# EAGLE design led_driver (EAGLE 6.5.0)
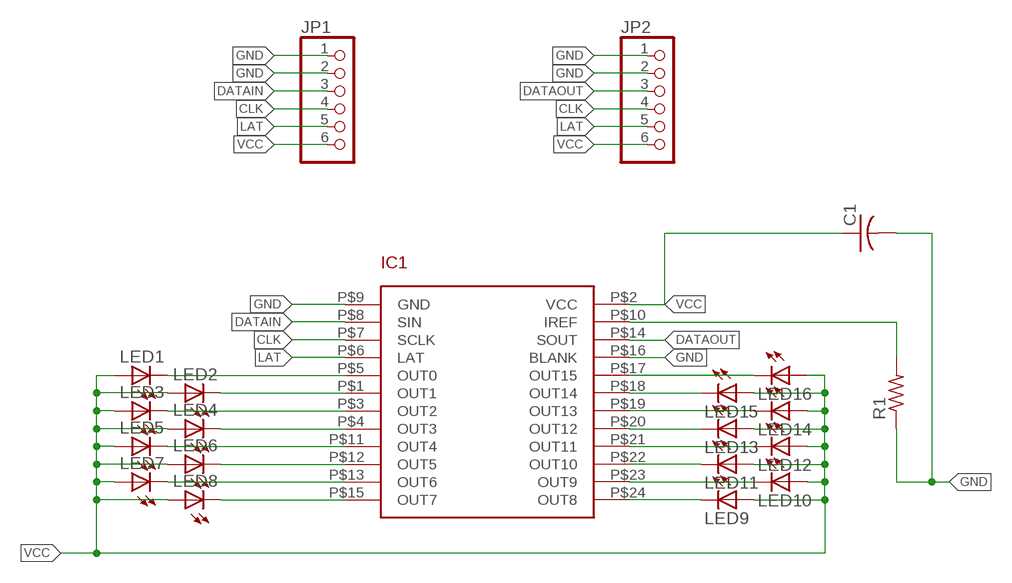
[diagram p0: schematic, sheet 1]

## Parts
C1  C-USC1206  [C1206]
IC1  TLC59282  [SSOP-24]
JP1  PINHD-1X6  [1X06]
JP2  PINHD-1X6  [1X06]
LED1  LED3MM  [LED3MM]
LED2  LED3MM  [LED3MM]
LED3  LED3MM  [LED3MM]
LED4  LED3MM  [LED3MM]
LED5  LED3MM  [LED3MM]
LED6  LED3MM  [LED3MM]
LED7  LED3MM  [LED3MM]
LED8  LED3MM  [LED3MM]
LED9  LED3MM  [LED3MM]
LED10  LED3MM  [LED3MM]
LED11  LED3MM  [LED3MM]
LED12  LED3MM  [LED3MM]
LED13  LED3MM  [LED3MM]
LED14  LED3MM  [LED3MM]
LED15  LED3MM  [LED3MM]
LED16  LED3MM  [LED3MM]
R1  R-US_0207/10  [0207/10]

## Nets
CLK: IC1.P$7(SCLK) JP1.4 JP2.4
DATAIN: IC1.P$8(SIN) JP1.3
DATAOUT: IC1.P$14(SOUT) JP2.3
GND: C1.2 IC1.P$9(GND) IC1.P$16(BLANK) JP1.1 JP1.2 JP2.1 JP2.2 R1.1
LAT: IC1.P$6(LAT) JP1.5 JP2.5
N$1: IC1.P$5(OUT0) LED1.K(C)
N$2: IC1.P$1(OUT1) LED2.K(C)
N$3: IC1.P$3(OUT2) LED3.K(C)
N$4: IC1.P$4(OUT3) LED4.K(C)
N$5: IC1.P$11(OUT4) LED5.K(C)
N$6: IC1.P$12(OUT5) LED6.K(C)
N$7: IC1.P$13(OUT6) LED7.K(C)
N$8: IC1.P$15(OUT7) LED8.K(C)
N$10: IC1.P$17(OUT15) LED16.K(C)
N$11: IC1.P$18(OUT14) LED15.K(C)
N$12: IC1.P$19(OUT13) LED14.K(C)
N$13: IC1.P$20(OUT12) LED13.K(C)
N$14: IC1.P$21(OUT11) LED12.K(C)
N$15: IC1.P$22(OUT10) LED11.K(C)
N$16: IC1.P$23(OUT9) LED10.K(C)
N$17: IC1.P$24(OUT8) LED9.K(C)
N$19: IC1.P$10(IREF) R1.2
VCC: C1.1 IC1.P$2(VCC) JP1.6 JP2.6 LED1.A LED2.A LED3.A LED4.A LED5.A LED6.A LED7.A LED8.A LED9.A LED10.A LED11.A LED12.A LED13.A LED14.A LED15.A LED16.A

## Library data of the parts
C1 = adafruit:C-US: CAPACITOR, American symbol
IC1 = TI LED Driver:TLC59282
JP1 JP2 = adafruit:PINHD-1X6: PIN HEADER
LED1-LED16 = adafruit:LED: LED OSRAM: - CHIPLED LG R971, LG N971, LY N971, LG Q971, LY Q971, LO R971, LY R971 LH N974, LH R974 LS Q976, LO Q976, LY Q976 LO Q996 - Hyper CHIPLED LW Q18S LB Q993, LB Q99A, LB R99A - SideLED LS A670, LO A670, LY A670, LG A670, LP A670 LB A673, LV A673, LT A673, LW A673 LH A674 LY A675 LS A676, LA A676, LO A676, LY A676, LW A676 LS A679, LY A679, LG A679 - Hyper Micro SIDELED® LS Y876, LA Y876, LO Y876, LY Y876 LT Y87S - SmartLED LW L88C, LW L88S LB L89C, LB L89S, LG L890 LS L89K, LO L89K, LY L89K LS L896, LA L896, LO L896, LY L896 - TOPLED LS T670, LO T670, LY T670, LG T670, LP T670 LSG T670, LSP T670, LSY T670, LOP T670, LYG T670 LG T671, LOG T671, LSG T671 LB T673, LV T673, LT T673, LW T673 LH T674 LS T676, LA T676, LO T676, LY T676, LB T676, LH T676, LSB T676, LW T676 LB T67C, LV T67C, LT T67C, LS T67K, LO T67K, LY T67K, LW E67C LS E67B, LA E67B, LO E67B, LY E67B, LB E67C, LV E67C, LT E67C LW T67C LS T679, LY T679, LG T679 LS T770, LO T770, LY T770, LG T770, LP T770 LB T773, LV T773, LT T773, LW T773 LH T774 LS E675, LA E675, LY E675, LS T675 LS T776, LA T776, LO T776, LY T776, LB T776 LHGB T686 LT T68C, LB T68C - Hyper Mini TOPLED® LB M676 - Mini TOPLED Santana® LG M470 LS M47K, LO M47K, LY M47K Source: http://www.osram.convergy.de/
R1 = rcl:R-US_: RESISTOR, American symbol

## Board
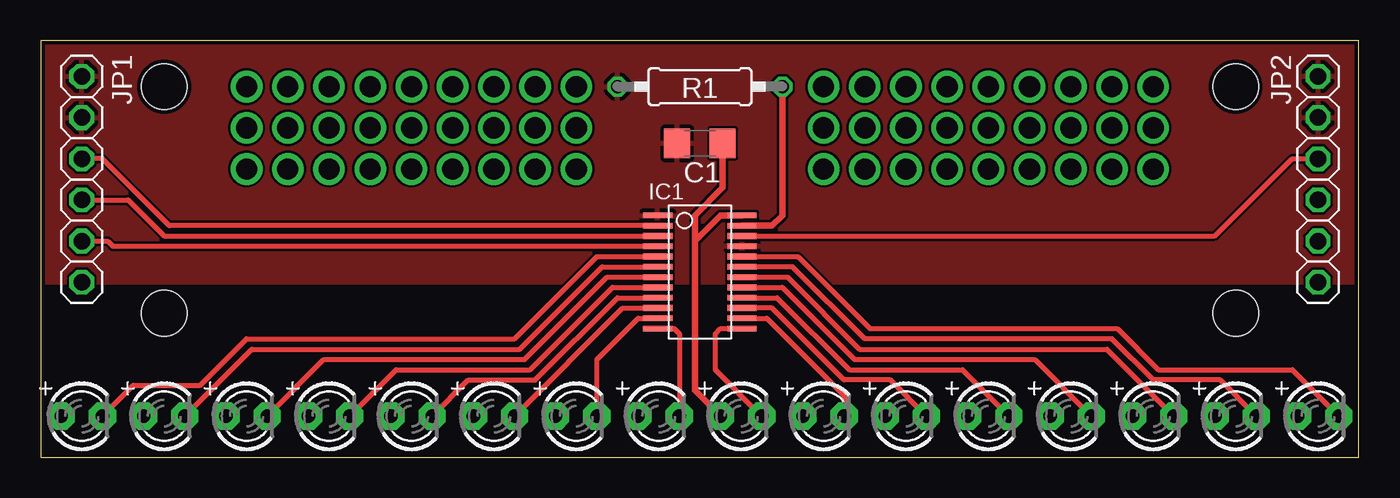
[diagram p1: board, top side]
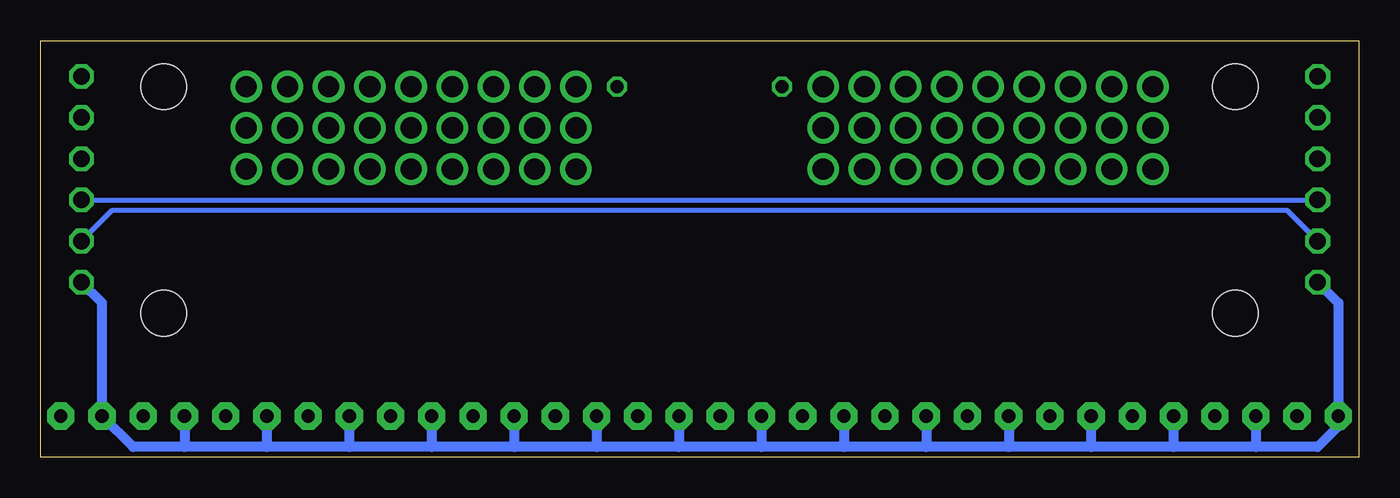
[diagram p2: board, bottom side, seen from below]

Size 81.26 x 25.7 mm. Coordinates in mm from the lower left corner, seen from the top.
Outline: 0,0 81.26,0 81.26,25.7 0,25.7 0,0
Copper layers (1*2*15*16): Top 0.035mm / dielectric 0.2mm / Route2 0.0175mm / dielectric 1.1mm / Route15 0.0175mm / dielectric 0.2mm / Bottom 0.035mm
Design rules "SeeedStudio_DRU_no_angle_20130527": minimum track width 6mil, minimum drill 12mil, track to track 6mil, track to pad 6mil, pad to pad 6mil, via to via 6mil, smd to smd 0mil, copper to edge 10mil, drill to drill 10mil, minimum pad ring 6mil, minimum via ring 6mil, stop-mask expansion 2mil, vias tented up to drill 25mil, thermal gap 10mil
Holes 2.8 mm at 7.62,8.89 7.62,22.86 73.66,8.89 73.66,22.86

### Footprints (pad centres in the part's own frame; a part is rotated, then mirrored left to right if it is on the bottom)
C1206 = smd 1.6 x 1.8: 1 -1.4,0; 2 1.4,0
SSOP-24 = smd 1.8 x 0.35: P$1 -2.6,0.318; P$2 2.6,3.493; P$3 -2.6,-0.318; P$4 -2.6,-0.953; P$5 -2.6,0.953; P$6 -2.6,1.587; P$7 -2.6,2.223; P$8 -2.6,2.857; P$9 -2.6,3.493; P$10 2.6,2.857; P$11 -2.6,-1.587; P$12 -2.6,-2.223; P$13 -2.6,-2.857; P$14 2.6,2.223; P$15 -2.6,-3.493; P$16 2.6,1.587; P$17 2.6,0.953; P$18 2.6,0.318; P$19 2.6,-0.318; P$20 2.6,-0.953; P$21 2.6,-1.587; P$22 2.6,-2.223; P$23 2.6,-2.857; P$24 2.6,-3.493
1X06 = drill 1.016 octagon: 1 -6.35,0; 2 -3.81,0; 3 -1.27,0; 4 1.27,0; 5 3.81,0; 6 6.35,0
LED3MM = drill 0.813 pad 1.676 octagon: A -1.27,0; K 1.27,0
0207/10 = drill 0.813 octagon: 1 -5.08,0; 2 5.08,0

### Placement (x,y rotation side)
C1  40.64,19.37 180 top
IC1  40.64,11.43 0 top
JP1  2.54,17.14 270 top
JP2  78.74,17.14 270 top
LED1  2.54,2.54 0 top
LED2  7.62,2.54 0 top
LED3  12.7,2.54 0 top
LED4  17.78,2.54 0 top
LED5  22.86,2.54 0 top
LED6  27.94,2.54 0 top
LED7  33.02,2.54 0 top
LED8  38.1,2.54 0 top
LED9  43.18,2.54 0 top
LED10  48.26,2.54 0 top
LED11  53.34,2.54 0 top
LED12  58.42,2.54 0 top
LED13  63.5,2.54 0 top
LED14  68.58,2.54 0 top
LED15  73.66,2.54 0 top
LED16  78.74,2.54 0 top
R1  40.64,22.86 0 top

### Tracks (layer width: path | path; a pad name or v marks a point on that pad's centre or on a via)
CLK
  Top 0.305: JP1.4 5.4,15.88 7.62,13.65 IC1.P$7
  Bottom 0.305: JP2.4 JP1.4
DATAIN
  Top 0.305: IC1.P$8 7.94,14.29 3.81,18.41 JP1.3
DATAOUT
  Top 0.305: IC1.P$14 72.39,13.65 77.15,18.41 JP2.3
GND
  pour Top: -0.32,26.04 81.92,26.04 81.92,10.79 -0.32,10.79
LAT
  Top 0.305: JP1.5 4.13,13.34 4.45,13.02 IC1.P$6
  Bottom 0.305: JP2.5 76.83,15.24 4.45,15.24 JP1.5
N$1
  Top 0.305: LED1.K 5.71,4.45 9.84,4.45 12.7,7.3 29.21,7.3 34.29,12.38 IC1.P$5
N$2
  Top 0.305: LED2.K 13.02,6.67 29.53,6.67 34.61,11.75 IC1.P$1
N$3
  Top 0.305: LED3.K 17.46,6.03 29.84,6.03 34.92,11.11 IC1.P$3
N$4
  Top 0.305: LED4.K 21.91,5.4 30.16,5.4 35.24,10.48 IC1.P$4
N$5
  Top 0.305: LED5.K 26.35,4.76 30.48,4.76 35.56,9.84 IC1.P$11
N$6
  Top 0.305: LED6.K 35.88,9.21 IC1.P$12
N$7
  Top 0.305: LED7.K 34.29,6.03 36.83,8.57 IC1.P$13
N$8
  Top 0.305: IC1.P$15 39.05,7.94 39.37,7.62 LED8.K
N$9  (via drill 1.3)
  other vias: 12.7,22.86
N$10
  Top 0.305: IC1.P$17 46.67,12.38 51.12,7.94 66.36,7.94 68.9,5.4 77.15,5.4 LED16.K
N$11
  Top 0.305: LED15.K 72.71,4.76 68.58,4.76 66.04,7.3 50.8,7.3 46.35,11.75 IC1.P$18
N$12
  Top 0.305: IC1.P$19 46.04,11.11 50.48,6.67 65.72,6.67 LED14.K
N$13
  Top 0.305: IC1.P$20 45.72,10.48 50.16,6.03 61.28,6.03 LED13.K
N$14
  Top 0.305: IC1.P$21 45.4,9.84 49.85,5.4 56.83,5.4 LED12.K
N$15
  Top 0.305: LED11.K 52.39,4.76 49.53,4.76 45.09,9.21 IC1.P$22
N$16
  Top 0.305: IC1.P$23 44.77,8.57 49.53,3.81 LED10.K
N$17
  Top 0.305: LED9.K 41.59,5.4 41.59,7.62 41.91,7.94 IC1.P$24
N$18  (via drill 1.3)
  other vias: 12.7,20.32
N$19
  Top 0.406: IC1.P$10 45.09,14.29 45.72,14.92 R1.2
N$20  (via drill 1.3)
  other vias: 12.7,17.78
N$21  (via drill 1.3)
  other vias: 15.24,17.78
N$22  (via drill 1.3)
  other vias: 15.24,20.32
N$23  (via drill 1.3)
  other vias: 15.24,22.86
N$24  (via drill 1.3)
  other vias: 17.78,22.86
N$25  (via drill 1.3)
  other vias: 17.78,20.32
N$26  (via drill 1.3)
  other vias: 17.78,17.78
N$27  (via drill 1.3)
  other vias: 20.32,17.78
N$28  (via drill 1.3)
  other vias: 20.32,20.32
N$29  (via drill 1.3)
  other vias: 20.32,22.86
N$30  (via drill 1.3)
  other vias: 22.86,22.86
N$31  (via drill 1.3)
  other vias: 22.86,20.32
N$32  (via drill 1.3)
  other vias: 22.86,17.78
N$33  (via drill 1.3)
  other vias: 25.4,17.78
N$34  (via drill 1.3)
  other vias: 25.4,20.32
N$35  (via drill 1.3)
  other vias: 25.4,22.86
N$36  (via drill 1.3)
  other vias: 27.94,17.78
N$37  (via drill 1.3)
  other vias: 27.94,20.32
N$38  (via drill 1.3)
  other vias: 27.94,22.86
N$39  (via drill 1.3)
  other vias: 30.48,22.86
N$40  (via drill 1.3)
  other vias: 30.48,20.32
N$41  (via drill 1.3)
  other vias: 30.48,17.78
N$42  (via drill 1.3)
  other vias: 33.02,17.78
N$43  (via drill 1.3)
  other vias: 33.02,20.32
N$44  (via drill 1.3)
  other vias: 33.02,22.86
N$45  (via drill 1.3)
  other vias: 48.26,20.32
N$46  (via drill 1.3)
  other vias: 50.8,20.32
N$47  (via drill 1.3)
  other vias: 53.34,20.32
N$48  (via drill 1.3)
  other vias: 55.88,20.32
N$49  (via drill 1.3)
  other vias: 58.42,20.32
N$50  (via drill 1.3)
  other vias: 60.96,20.32
N$51  (via drill 1.3)
  other vias: 63.5,20.32
N$52  (via drill 1.3)
  other vias: 66.04,20.32
N$53  (via drill 1.3)
  other vias: 68.58,20.32
N$54  (via drill 1.3)
  other vias: 68.58,17.78
N$55  (via drill 1.3)
  other vias: 66.04,17.78
N$56  (via drill 1.3)
  other vias: 63.5,17.78
N$57  (via drill 1.3)
  other vias: 60.96,17.78
N$58  (via drill 1.3)
  other vias: 58.42,17.78
N$59  (via drill 1.3)
  other vias: 55.88,17.78
N$60  (via drill 1.3)
  other vias: 53.34,17.78
N$61  (via drill 1.3)
  other vias: 50.8,17.78
N$62  (via drill 1.3)
  other vias: 48.26,17.78
N$63  (via drill 1.3)
  other vias: 48.26,22.86
N$64  (via drill 1.3)
  other vias: 50.8,22.86
N$65  (via drill 1.3)
  other vias: 53.34,22.86
N$66  (via drill 1.3)
  other vias: 55.88,22.86
N$67  (via drill 1.3)
  other vias: 58.42,22.86
N$68  (via drill 1.3)
  other vias: 60.96,22.86
N$69  (via drill 1.3)
  other vias: 63.5,22.86
N$70  (via drill 1.3)
  other vias: 66.04,22.86
N$71  (via drill 1.3)
  other vias: 68.58,22.86
VCC
  Top 0.406: IC1.P$2 41.91,14.92 40.32,13.34 | 40.32,13.34 40.32,4.13 LED9.A | C1.1 42.04,16.64 40.32,14.92 40.32,13.34
  Bottom 0.61: JP1.6 1.27,9.53 LED1.A 1.27,1.91 2.54,0.64 6.35,0.64 | 6.35,0.64 11.43,0.64 | 11.43,0.64 16.51,0.64 | 16.51,0.64 21.59,0.64 | 21.59,0.64 26.67,0.64 | 26.67,0.64 31.75,0.64 | 31.75,0.64 36.83,0.64 | 36.83,0.64 41.91,0.64 | 41.91,0.64 46.99,0.64 | 46.99,0.64 52.07,0.64 | 52.07,0.64 57.15,0.64 | 57.15,0.64 62.23,0.64 | 62.23,0.64 67.31,0.64 | 67.31,0.64 72.39,0.64 | 72.39,0.64 75.56,0.64 LED16.A 77.47,9.53 JP2.6 | LED15.A 72.39,0.64 | LED14.A 67.31,0.64 | LED13.A 62.23,0.64 | LED12.A 57.15,0.64 | LED11.A 52.07,0.64 | LED10.A 46.99,0.64 | LED9.A 41.91,0.64 | LED8.A 36.83,0.64 | LED7.A 31.75,0.64 | LED6.A 26.67,0.64 | LED5.A 21.59,0.64 | LED4.A 16.51,0.64 | LED3.A 11.43,0.64 | LED2.A 6.35,0.64